# Altium project LM-002-F.PrjPcb (part 2 of 2)

## Sheet ZP.SchDoc: ZP
size OrCAD A; DocumentNumber: LM-002; Revision: F; SheetNumber: 5; SheetTotal: 5
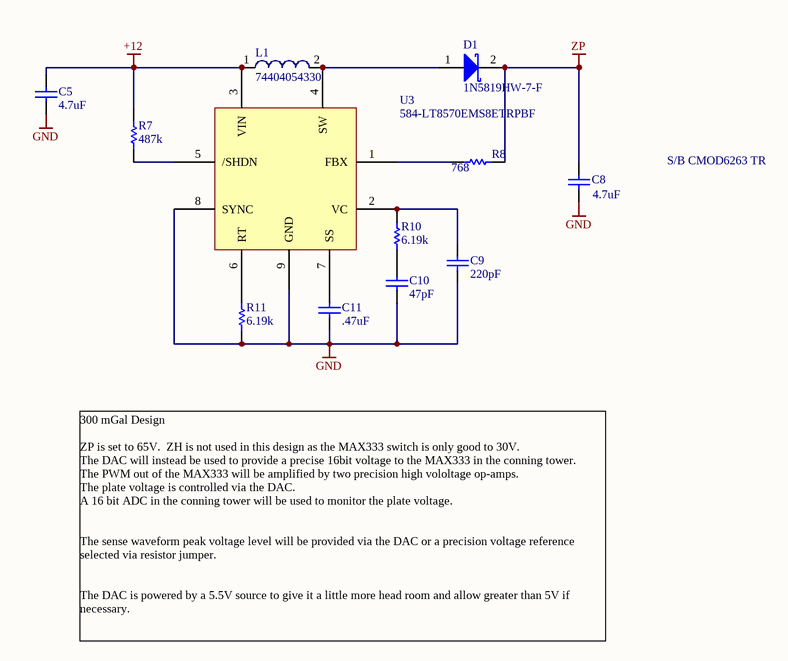
[diagram p4: ZP.SchDoc]

### Parts
C5  4.7uF  [CAPC0805(2012)155_L]
C8  Capacitance: 4.7uF  [CAPC0805(2012)155_L]  (hidden comment: CAP CER 1UF 25V X7R 0805)
C9  220pF  [CAPC0402(1005)60_L]
C10  47pF  [CAPC0402(1005)60_L]
C11  .47uF  [CAPC0402(1005)60_L]
D1  1N5819HW-7-F  [DIOD-SOD-123-2_V]
L1  74404054330  [WE-LQS 5040]
R7  487k  [RESC0402(1005)_M]
R8  768  [RESC0402(1005)_M]
R10  6.19k  [RESC0402(1005)_M]
R11  6.19k  [RESC0402(1005)_M]
U3  Supplier Part Number 1: 584-LT8570EMS8ETRPBF  [LT8570-MSOP]  (hidden comment: LT8570)

### Nets
+12: C5.2 L1.1 R7.1 U3.3(VIN)
GND: C5.1 C8.1 C9.1 C10.1 C11.1 R11.2 U3.8(SYNC) U3.9(GND)
ZP: C8.2 D1.2(K) R8.2
NetC9_2: C9.2 R10.1 U3.2(VC)
NetC10_2: C10.2 R10.2
NetC11_2: C11.2 U3.7(SS)
NetD1_1: D1.1(A) L1.2 U3.4(SW)
NetR7_2: R7.2 U3.5(/SHDN)
NetR8_1: R8.1 U3.1(FBX)
NetR11_1: R11.1 U3.6(RT)

### Notes on the sheet
- S/B CMOD6263 TR
- 300 mGal Design
  ZP is set to 65V.  ZH is not used in this design as the MAX333 switch is only good to 30V.
  The DAC will instead be used to provide a precise 16bit voltage to the MAX333 in the conning tower.
  The PWM out of the MAX333 will be amplified by two precision high vololtage op-amps.
  The plate voltage is controlled via the DAC.
  A 16 bit ADC in the conning tower will be used to monitor the plate voltage.
  The sense waveform peak voltage level will be provided via the DAC or a precision voltage reference selected via resistor jumper.
  The DAC is powered by a 5.5V source to give it a little more head room and allow greater than 5V if necessary.
- Title
- Size:
- Date:
- Orcad A
- Number:
- Time:
- Revision:
- Sheet
- of
- ZLS Corporation
- 7801 North Lamar Blvd.
- Suite E-184
- Austin, Texas 78752  USA
- (512) 453-0288
- File:

### Library data of the parts
C5 = CMP-1036-04882-1
C8 = CMP-1036-04882-1: Manufacturer: Murata Electronics North America; Manufacturer Part Number: GRM21BR71E105KA99L; Tolerance: ±10%; Supplier 1: Digi-Key; Supplier Part Number 1: 490-6484-6-ND; RoHS: RoHS Compliant; Category: Capacitors; Stock 1: 295074; Pricing 1: 1=0.14, 10=0.099, 100=0.0468, 500=0.0328, 1000=0.02715 (USD); Packaging: Digi-Reel®; Part Status: Active; Voltage - Rated: 25V; Temperature Coefficient: X7R; Operating Temperature: -55°C ~ 125°C; Features: -; Ratings: -; Applications: General Purpose; Mounting Type: Surface Mount, MLCC; Package / Case: 0805 (2012 Metric); Size / Dimension: 0.079" L x 0.049" W (2.00mm x 1.25mm); Height - Seated (Max): -; Thickness (Max): 0.053" (1.35mm); Lead Spacing: -; Lead Style: -; ComponentLink1URL: http://www.murata.com/~/media/webrenewal/support/library/catalog/products/capacitor/mlcc/c02e.ashx; ComponentLink1Description: http://www.murata.com/~/media/webrenewal/support/library/catalog/products/capacitor/mlcc/c02e.ashx
C9-C11 = CMP-1034-00252-1: CAP CER 0.1UF 10V X7R 0402
D1 = CMP-0303-00003-1: 1.0 A Surface Mount Schottky Barrier Rectifier, 40 V, -65 to 125 degC, 2-Pin SOD-123 Package, RoHS, Tape and Reel; Manufacturer: Diodes Inc; @ VR (V): 40; @ Terminal Temperature TT (degC): 90; Maximum Average Rectified Current IO (A): 1; Total Capacitance CT (pF): 50; Peak Forward Surge Current IFSM (A): 25; Forward Voltage Drop VF (V): 0.45; VR (RMS) (V): 28; RoHS: TRUE; PartNumber: 1N5819HW-7-F; ComponentLink2URL: http://www.diodes.com/datasheets/ds30217.pdf; PackageDescription: 2-Pin SOD-123, Body 2.7 x 1.55 mm, Pitch 3.7 mm; @ IF (A): 1; Operating and Storage Temperature Range: -65 to 125 degC; ComponentLink1Description: Manufacturer URL; ComponentLink2Description: Datasheet; ComponentLink1URL: http://www.diodes.com/; Mounting Technology: Surface Mount; DatasheetVersion: Rev. 15-2; PackageReference: SOD-123-2; Maximum Reverse Current IR (uA): 50; Peak Repetitive Reverse Voltage VRRM (V): 40; Packing: Tape and Reel
L1 = CMP-1354-00041-1: WE-LQS SMD Power Inductor, L=33.0 µH; Manufacturer: Wuerth Elektronik; Inductance: 33.0 ÂµH; PackageReference: WE-LQS 5040; ComponentLink1URL: http://www.we-online.com; ComponentLink2URL: http://katalog.we-online.de/pbs/datasheet/74404054330.pdf; ComponentLink2Description: Datasheet; PartNumber: 74404054330; ComponentLink1Description: Manufacturer URL
R7 R8 R10 R11 = CMP-1011-00463-1
U3 = LT8570: IC REG MULT CONFIG INV ADJ 8MSOP; Supplier 1: Mouser

## Nets that join several sheets
+3.3: Voltage_Sources (U4.12), Sense&Connectors (5 pins), ADC (C26.2 U16.3)
+5: Synch_Demod (C2.1 R2.2 U1.8), Voltage_Sources (C6.2 U2.4 U2.6), Sense&Connectors (P1.4 P2.2 P3.22), ADC (8 pins)
+5R: Voltage_Sources (U5.1 U5.4), Sense&Connectors (R13.1), ADC (R34.2)
+12: Voltage_Sources (C12.2 C13.1 U5.5 U6.2), Sense&Connectors (10 pins), ZP (C5.2 L1.1 R7.1 U3.3)
-5: Synch_Demod (C3.1 U1.4), Sense&Connectors (5 pins)
ADC REF: Voltage_Sources (U4.1), ADC (C29.1 U16.6 U17.5 U17.6)
GND: Synch_Demod (C2.2 C3.2 C4.1 R5.1), Voltage_Sources (16 pins), Sense&Connectors (33 pins), ADC (15 pins), ZP (8 pins)
ZH: Sense&Connectors (P1.16), ADC (R29.2)
ZP: Sense&Connectors (P1.15), ADC (R32.2), ZP (C8.2 D1.2 R8.2)
Beam Sync Demod Out: Synch_Demod (C4.2 R2.1 R4.1 TP1.1), ADC (R31.2)
Beam_mod: Synch_Demod (R3.2 TP2.1), Sense&Connectors (U8.8)
DAC1_OUT: Voltage_Sources (TP4.1 U4.3), Sense&Connectors (R15.1)
DAC_CS0: Voltage_Sources (U4.13), Sense&Connectors (P3.10)
FB_CS0: Sense&Connectors (P3.6), ADC (U16.9)
FB_MUX_A0: Sense&Connectors (P2.25), ADC (U15.14)
FB_MUX_A1: Sense&Connectors (P2.27), ADC (U15.1)
SPI0_MISO: Voltage_Sources (U4.16), Sense&Connectors (P1.9 P3.11 U10.6), ADC (U16.1)
SPI0_MOSI: Voltage_Sources (U4.15), Sense&Connectors (P3.9 U10.5)
SPI0_SCLK: Voltage_Sources (U4.14), Sense&Connectors (P1.7 P3.13 U10.4), ADC (U16.10)